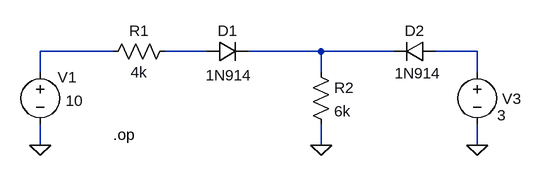
[diagram p0: schematic DidesCircuitEx2.asc]
DidesCircuitEx2.asc, the LTspice schematic file:
Version 4
SHEET 1 880 680
WIRE -256 112 -368 112
WIRE -112 112 -176 112
WIRE 64 112 -48 112
WIRE 176 112 64 112
WIRE 304 112 240 112
WIRE -368 144 -368 112
WIRE 64 144 64 112
WIRE 304 144 304 112
WIRE -368 256 -368 224
WIRE 64 256 64 224
WIRE 304 256 304 224
FLAG -368 256 0
FLAG 304 256 0
FLAG 64 256 0
SYMBOL voltage -368 128 R0
WINDOW 123 0 0 Left 2
WINDOW 39 0 0 Left 2
WINDOW 3 39 60 Left 2
WINDOW 0 27 24 Left 2
SYMATTR Value 10
SYMATTR InstName V1
SYMBOL res -272 128 R270
WINDOW 0 32 56 VTop 2
WINDOW 3 0 56 VBottom 2
SYMATTR InstName R1
SYMATTR Value 4k
SYMBOL diode 240 96 R90
WINDOW 0 0 32 VBottom 2
WINDOW 3 34 27 VTop 2
SYMATTR InstName D2
SYMATTR Value 1N914
SYMBOL voltage 304 128 R0
WINDOW 123 0 0 Left 2
WINDOW 39 0 0 Left 2
WINDOW 3 31 82 Left 2
WINDOW 0 39 57 Left 2
SYMATTR Value 3
SYMATTR InstName V3
SYMBOL diode -112 128 R270
WINDOW 0 32 32 VTop 2
WINDOW 3 -5 34 VBottom 2
SYMATTR InstName D1
SYMATTR Value 1N914
SYMBOL res 48 128 R0
SYMATTR InstName R2
SYMATTR Value 6k
TEXT -256 240 Left 2 !.op

The netlist it stands for:
* DidesCircuitEx2.asc
V1 N001 0 10
R1 N001 N002 4k
D2 N004 N003 1N914
V3 N004 0 3
D1 N002 N003 1N914
R2 N003 0 6k
.model D D
.lib standard.dio
.op
.backanno
.end